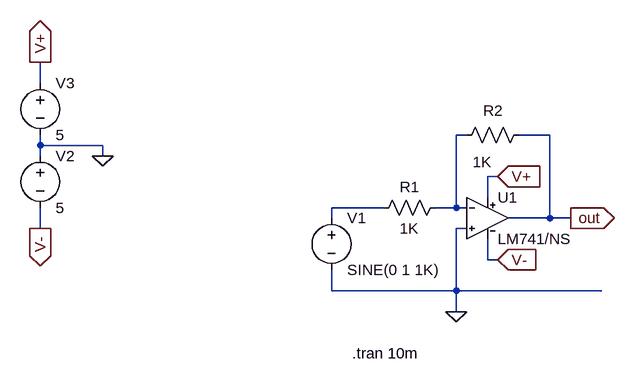
[diagram p0: schematic LM741_test.asc]
LM741_test.asc, the LTspice schematic file:
Version 4
SHEET 1 1244 680
WIRE -512 -48 -512 -80
WIRE 144 32 128 32
WIRE 272 32 224 32
WIRE -512 48 -512 32
WIRE -416 48 -512 48
WIRE -512 64 -512 48
WIRE -416 64 -416 48
WIRE 192 96 176 96
WIRE 176 128 176 96
WIRE 16 144 -64 144
WIRE 128 144 128 32
WIRE 128 144 96 144
WIRE 144 144 128 144
WIRE -64 160 -64 144
WIRE 272 160 272 32
WIRE 272 160 208 160
WIRE 304 160 272 160
WIRE -512 176 -512 144
WIRE 144 176 128 176
WIRE 176 224 176 192
WIRE 192 224 176 224
WIRE -64 272 -64 240
WIRE 128 272 128 176
WIRE 128 272 -64 272
WIRE 352 272 128 272
WIRE 128 304 128 272
FLAG 128 304 0
FLAG 304 160 out
IOPIN 304 160 Out
FLAG 192 96 V+
IOPIN 192 96 In
FLAG 192 224 V-
IOPIN 192 224 In
FLAG -416 64 0
FLAG -512 -80 V+
IOPIN -512 -80 Out
FLAG -512 176 V-
IOPIN -512 176 Out
SYMBOL res 112 128 R90
WINDOW 0 0 56 VBottom 2
WINDOW 3 32 56 VTop 2
SYMATTR InstName R1
SYMATTR Value 1K
SYMBOL res 240 16 R90
WINDOW 0 -6 55 VBottom 2
WINDOW 3 42 72 VTop 2
SYMATTR InstName R2
SYMATTR Value 1K
SYMBOL voltage -64 144 R0
WINDOW 123 0 0 Left 0
WINDOW 39 0 0 Left 0
SYMATTR InstName V1
SYMATTR Value SINE(0 1 1K)
SYMBOL voltage -512 48 R0
WINDOW 123 0 0 Left 0
WINDOW 39 0 0 Left 0
SYMATTR InstName V2
SYMATTR Value 5
SYMBOL voltage -512 -64 R0
WINDOW 123 0 0 Left 0
WINDOW 39 0 0 Left 0
SYMATTR InstName V3
SYMATTR Value 5
SYMBOL LM741 176 96 R0
SYMATTR InstName U1
SYMATTR Value LM741/NS
TEXT -32 368 Left 2 !.tran 10m

The netlist it stands for:
* LM741_test.asc
R1 N001 N002 1K
R2 out N001 1K
V1 N002 0 SINE(0 1 1K)
V2 0 V- 5
V3 V+ 0 5
XU1 0 N001 V+ V- out LM741/NS  ; pins In+ In- V+ V- OUT
.tran 10m
.lib LM741.MOD
.backanno
.end